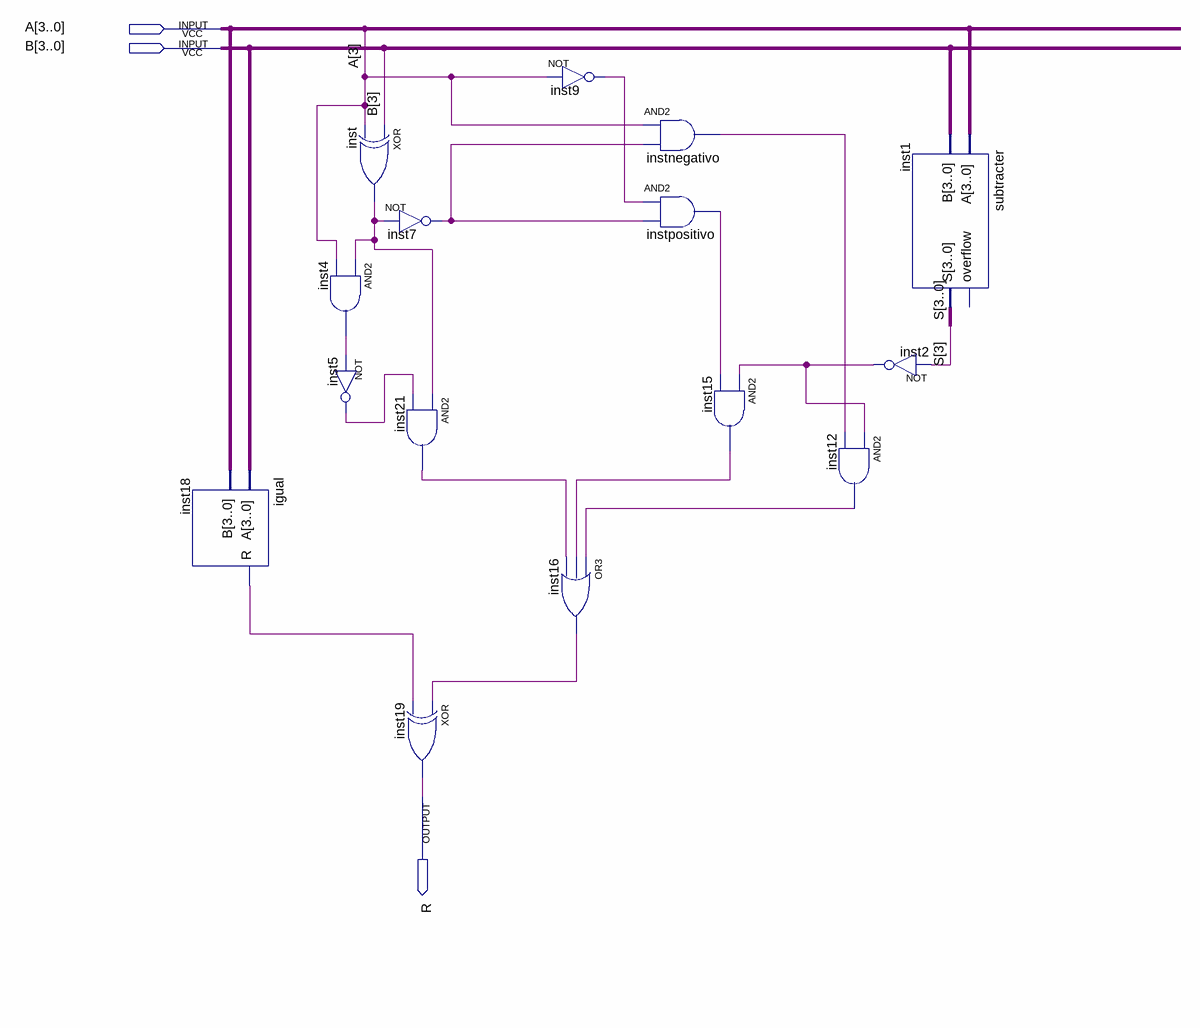
[diagram p0: schematic sheet]
// Quartus schematic maiorque.bdf as structural Verilog: 15 symbols, 3 pins
module maiorque (
  input  [3:0] A,
  input  [3:0] B,
  output R
);

  wire inst2_out, inst4_out, inst5_out, inst7_out, inst9_out, inst12_out, inst15_out, inst16_out, inst18_r,
       inst21_out, inst_out, instnegativo_out, instpositivo_out;
  wire [3:0] S;

  igual inst18 (.A(B), .B(A), .R(inst18_r));
  and inst4 (inst4_out, inst_out, A[3]);
  not inst5 (inst5_out, inst4_out);
  xor inst (inst_out, B[3], A[3]);
  not inst7 (inst7_out, inst_out);
  and inst21 (inst21_out, inst_out, inst5_out);
  xor inst19 (R, inst16_out, inst18_r);
  not inst9 (inst9_out, A[3]);
  or inst16 (inst16_out, inst12_out, inst15_out, inst21_out);
  and instnegativo (instnegativo_out, A[3], inst7_out);
  and instpositivo (instpositivo_out, inst9_out, inst7_out);
  and inst15 (inst15_out, inst2_out, instpositivo_out);
  and inst12 (inst12_out, inst2_out, instnegativo_out);
  subtracter inst1 (.A(A), .B(B), .S(S));  // open: overflow
  not inst2 (inst2_out, S[3]);
endmodule
